# EasyEDA schematic SCH_Light_Matrix_2024-06-19.json
TITLE: Sheet_1; REV: 1.0; Date: 2024-05-13; Sheet: 1/1; Drawn By: arnav.purbiya; Company: Your Company
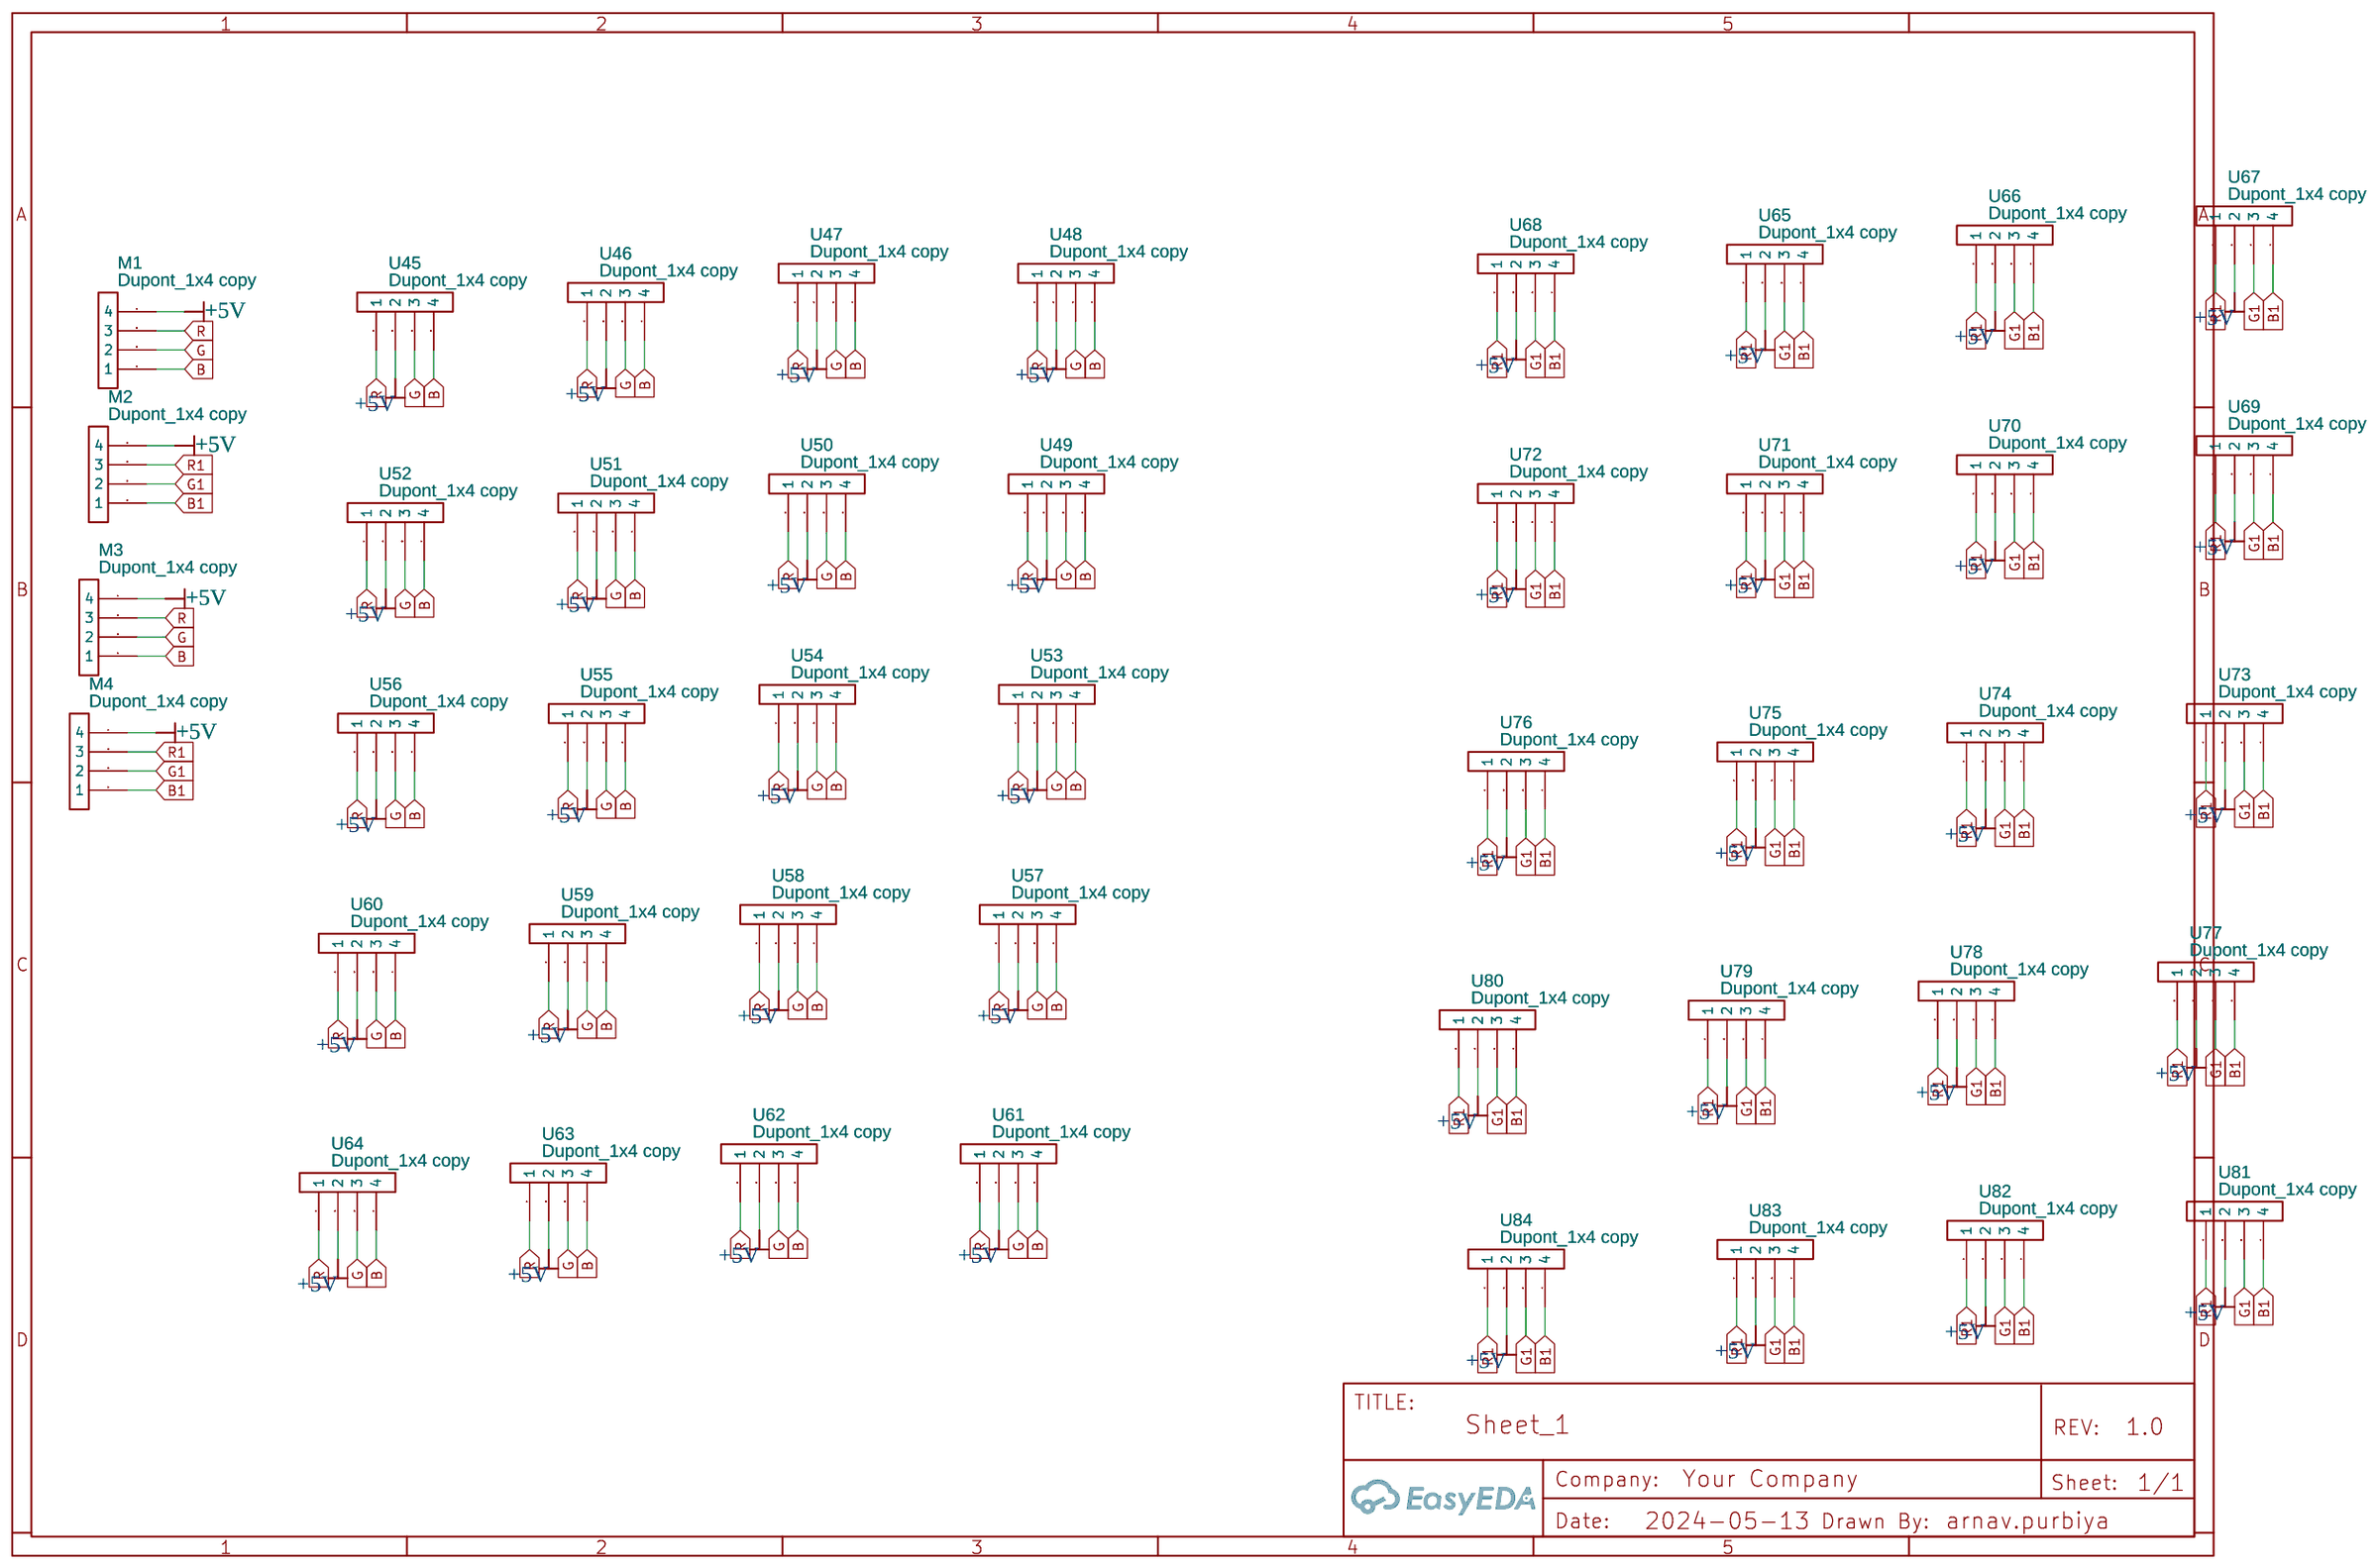
[diagram p0: schematic sheet]

## Parts
M1  Dupont_1x4 copy  [DUPONT_1X4]
M2  Dupont_1x4 copy  [DUPONT_1X4]
M3  Dupont_1x4 copy  [DUPONT_1X4]
M4  Dupont_1x4 copy  [DUPONT_1X4]
U45  Dupont_1x4 copy  [DUPONT_1X4]
U46  Dupont_1x4 copy  [DUPONT_1X4]
U47  Dupont_1x4 copy  [DUPONT_1X4]
U48  Dupont_1x4 copy  [DUPONT_1X4]
U49  Dupont_1x4 copy  [DUPONT_1X4]
U50  Dupont_1x4 copy  [DUPONT_1X4]
U51  Dupont_1x4 copy  [DUPONT_1X4]
U52  Dupont_1x4 copy  [DUPONT_1X4]
U53  Dupont_1x4 copy  [DUPONT_1X4]
U54  Dupont_1x4 copy  [DUPONT_1X4]
U55  Dupont_1x4 copy  [DUPONT_1X4]
U56  Dupont_1x4 copy  [DUPONT_1X4]
U57  Dupont_1x4 copy  [DUPONT_1X4]
U58  Dupont_1x4 copy  [DUPONT_1X4]
U59  Dupont_1x4 copy  [DUPONT_1X4]
U60  Dupont_1x4 copy  [DUPONT_1X4]
U61  Dupont_1x4 copy  [DUPONT_1X4]
U62  Dupont_1x4 copy  [DUPONT_1X4]
U63  Dupont_1x4 copy  [DUPONT_1X4]
U64  Dupont_1x4 copy  [DUPONT_1X4]
U65  Dupont_1x4 copy  [DUPONT_1X4]
U66  Dupont_1x4 copy  [DUPONT_1X4]
U67  Dupont_1x4 copy  [DUPONT_1X4]
U68  Dupont_1x4 copy  [DUPONT_1X4]
U69  Dupont_1x4 copy  [DUPONT_1X4]
U70  Dupont_1x4 copy  [DUPONT_1X4]
U71  Dupont_1x4 copy  [DUPONT_1X4]
U72  Dupont_1x4 copy  [DUPONT_1X4]
U73  Dupont_1x4 copy  [DUPONT_1X4]
U74  Dupont_1x4 copy  [DUPONT_1X4]
U75  Dupont_1x4 copy  [DUPONT_1X4]
U76  Dupont_1x4 copy  [DUPONT_1X4]
U77  Dupont_1x4 copy  [DUPONT_1X4]
U78  Dupont_1x4 copy  [DUPONT_1X4]
U79  Dupont_1x4 copy  [DUPONT_1X4]
U80  Dupont_1x4 copy  [DUPONT_1X4]
U81  Dupont_1x4 copy  [DUPONT_1X4]
U82  Dupont_1x4 copy  [DUPONT_1X4]
U83  Dupont_1x4 copy  [DUPONT_1X4]
U84  Dupont_1x4 copy  [DUPONT_1X4]

## Library data of the parts
M1-M4 U45-U84 = Dupont_1x4 copy: Manufacturer Part: Conector_dupont; Contributor: invenitec

## Nets
+5V: M1.4 M2.4 M3.4 M4.4 U45.2 U46.2 U47.2 U48.2 U49.2 U50.2 U51.2 U52.2 U53.2 U54.2 U55.2 U56.2 U57.2 U58.2 U59.2 U60.2 U61.2 U62.2 U63.2 U64.2 U65.2 U66.2 U67.2 U68.2 U69.2 U70.2 U71.2 U72.2 U73.2 U74.2 U75.2 U76.2 U77.2 U78.2 U79.2 U80.2 U81.2 U82.2 U83.2 U84.2
B: M1.1 M3.1 U45.4 U46.4 U47.4 U48.4 U49.4 U50.4 U51.4 U52.4 U53.4 U54.4 U55.4 U56.4 U57.4 U58.4 U59.4 U60.4 U61.4 U62.4 U63.4 U64.4
B1: M2.1 M4.1 U65.4 U66.4 U67.4 U68.4 U69.4 U70.4 U71.4 U72.4 U73.4 U74.4 U75.4 U76.4 U77.4 U78.4 U79.4 U80.4 U81.4 U82.4 U83.4 U84.4
G: M1.2 M3.2 U45.3 U46.3 U47.3 U48.3 U49.3 U50.3 U51.3 U52.3 U53.3 U54.3 U55.3 U56.3 U57.3 U58.3 U59.3 U60.3 U61.3 U62.3 U63.3 U64.3
G1: M2.2 M4.2 U65.3 U66.3 U67.3 U68.3 U69.3 U70.3 U71.3 U72.3 U73.3 U74.3 U75.3 U76.3 U77.3 U78.3 U79.3 U80.3 U81.3 U82.3 U83.3 U84.3
R: M1.3 M3.3 U45.1 U46.1 U47.1 U48.1 U49.1 U50.1 U51.1 U52.1 U53.1 U54.1 U55.1 U56.1 U57.1 U58.1 U59.1 U60.1 U61.1 U62.1 U63.1 U64.1
R1: M2.3 M4.3 U65.1 U66.1 U67.1 U68.1 U69.1 U70.1 U71.1 U72.1 U73.1 U74.1 U75.1 U76.1 U77.1 U78.1 U79.1 U80.1 U81.1 U82.1 U83.1 U84.1
